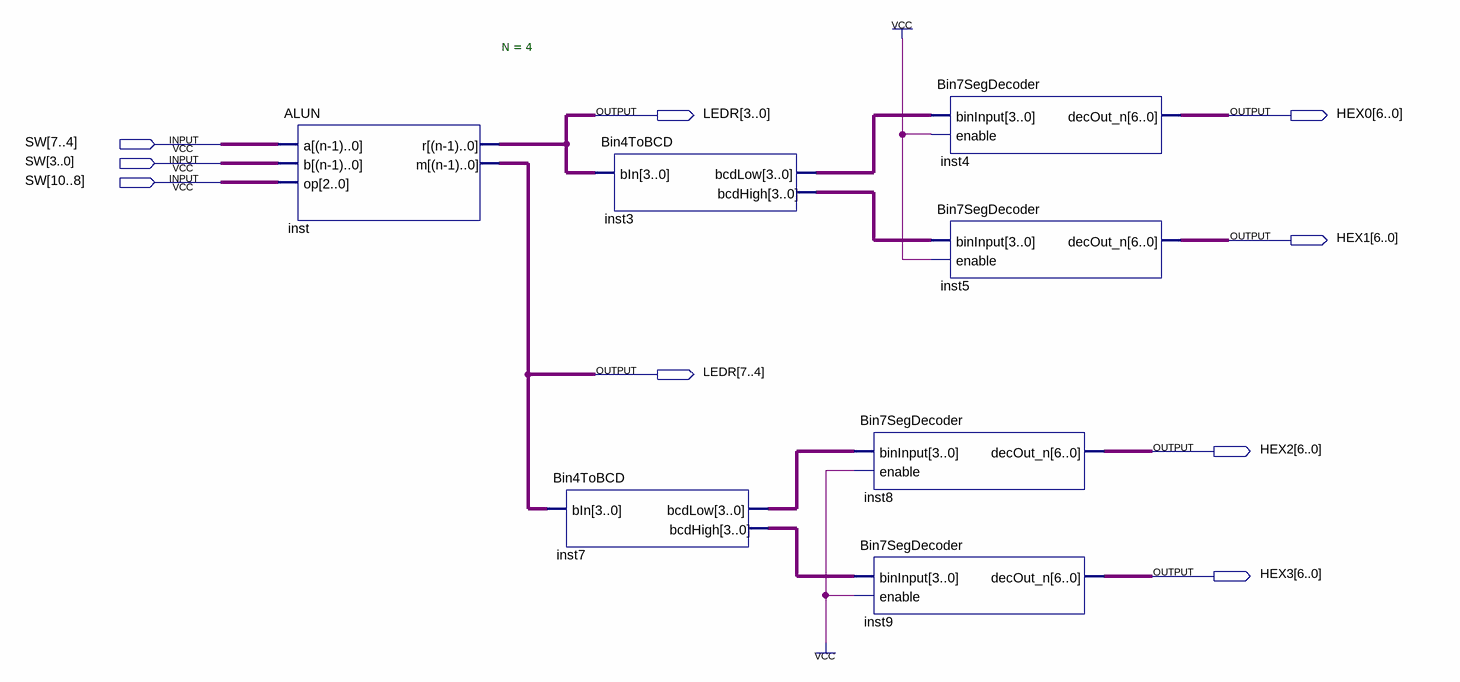
[diagram p0: schematic sheet]
// Quartus schematic ALUDemo.bdf as structural Verilog: 7 symbols, 9 pins
module ALUDemo (
  input  [10:0] SW,
  output [7:0] LEDR,
  output [6:0] HEX0,
  output [6:0] HEX1,
  output [6:0] HEX2,
  output [6:0] HEX3
);

  wire [3:0] inst3_bcdhigh, inst3_bcdlow, inst7_bcdhigh, inst7_bcdlow;

  ALUN #(.N(4)) inst (.a(SW[7:4]), .b(SW[3:0]), .op(SW[10:8]), .r(LEDR[3:0]), .m(LEDR[7:4]));
  Bin4ToBCD inst3 (.bIn(LEDR[3:0]), .bcdLow(inst3_bcdlow), .bcdHigh(inst3_bcdhigh));
  Bin4ToBCD inst7 (.bIn(LEDR[7:4]), .bcdLow(inst7_bcdlow), .bcdHigh(inst7_bcdhigh));
  Bin7SegDecoder inst8 (.binInput(inst7_bcdlow), .enable(1'b1), .decOut_n(HEX2));
  Bin7SegDecoder inst9 (.binInput(inst7_bcdhigh), .enable(1'b1), .decOut_n(HEX3));
  Bin7SegDecoder inst4 (.binInput(inst3_bcdlow), .enable(1'b1), .decOut_n(HEX0));
  Bin7SegDecoder inst5 (.binInput(inst3_bcdhigh), .enable(1'b1), .decOut_n(HEX1));
endmodule
